# EAGLE design t10_adapter_isp (EAGLE 6.1)
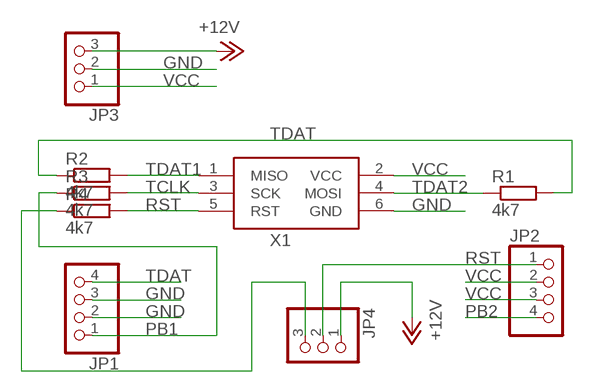
[diagram p0: schematic, sheet 1]

## Parts
JP1  PINHD-1X4  [1X04]
JP2  PINHD-1X4  [1X04]
JP3  PINHD-1X3  [1X03]
JP4  PINHD-1X3  [1X03]
R1  4k7  R-EU_M0805  [M0805]
R2  4k7  R-EU_M0805  [M0805]
R3  4k7  R-EU_M0805  [M0805]
R4  4k7  R-EU_M0805  [M0805]
X1  AVRISP-HEADER-6-SHROUDED  [CONN-HARTING-ML6]

## Nets
+12V: JP3.3 JP4.1
GND: JP1.2 JP1.3 JP3.2 X1.6(GND)
N$1: JP4.3 R4.1
PB1: JP1.1 R3.1
PB2: JP2.4
RST: JP2.1 JP4.2 R4.2 X1.5(RST)
TCLK: R3.2 X1.3(SCK)
TDAT: JP1.4 R1.2 R2.1
TDAT1: R2.2 X1.1(MISO)
TDAT2: R1.1 X1.4(MOSI)
VCC: JP2.2 JP2.3 JP3.1 X1.2(VCC)

## Library data of the parts
JP1 JP2 = pinhead:PINHD-1X4: PIN HEADER
JP3 JP4 = pinhead:PINHD-1X3: PIN HEADER
R1-R4 = rcl:R-EU_: RESISTOR, European symbol
X1 = SteveMarple:AVRISP: AVR ISP HEADER Standard 6 pin header for AVR programming

## Board
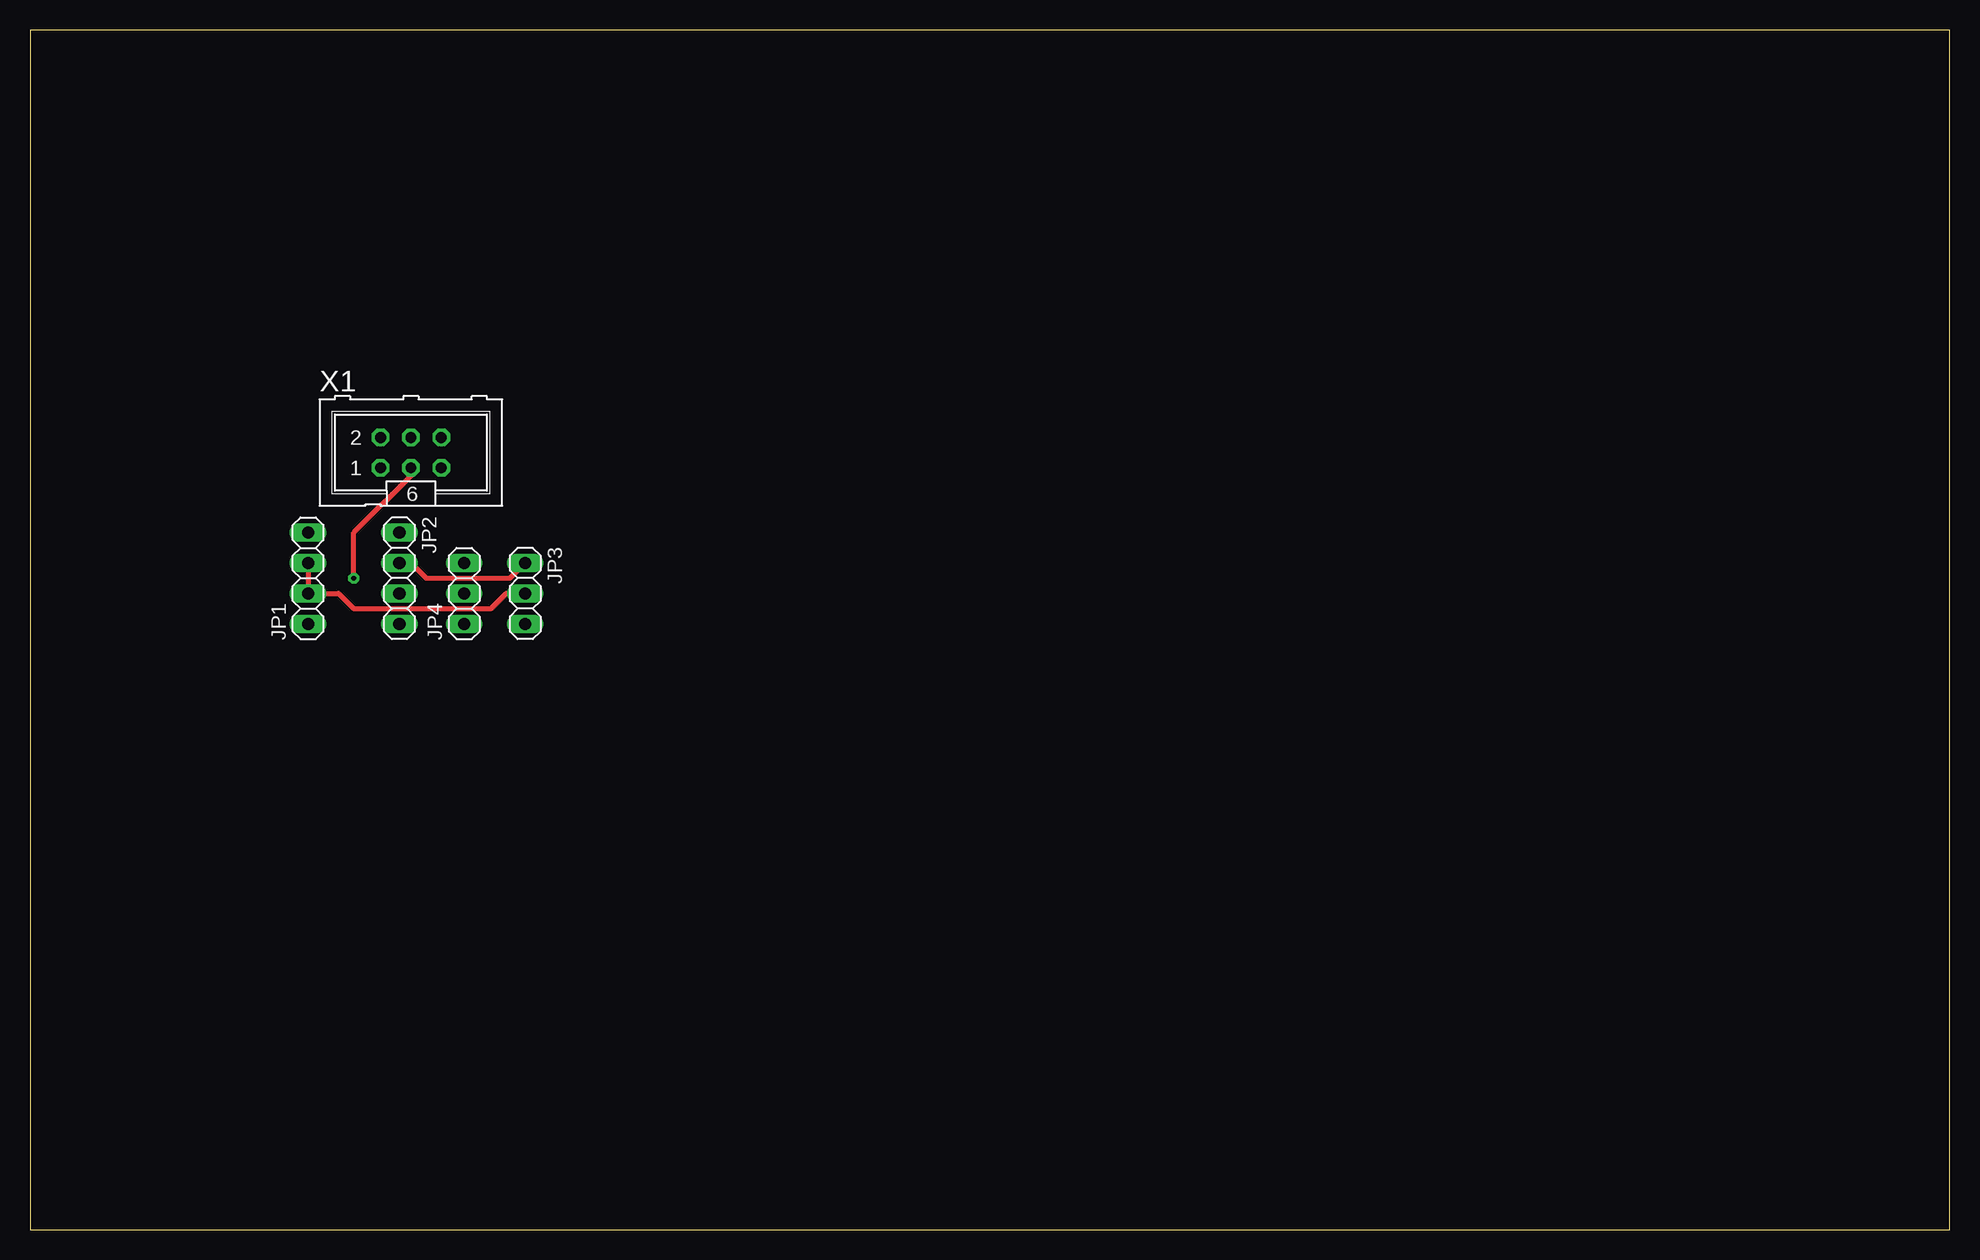
[diagram p1: board, top side]
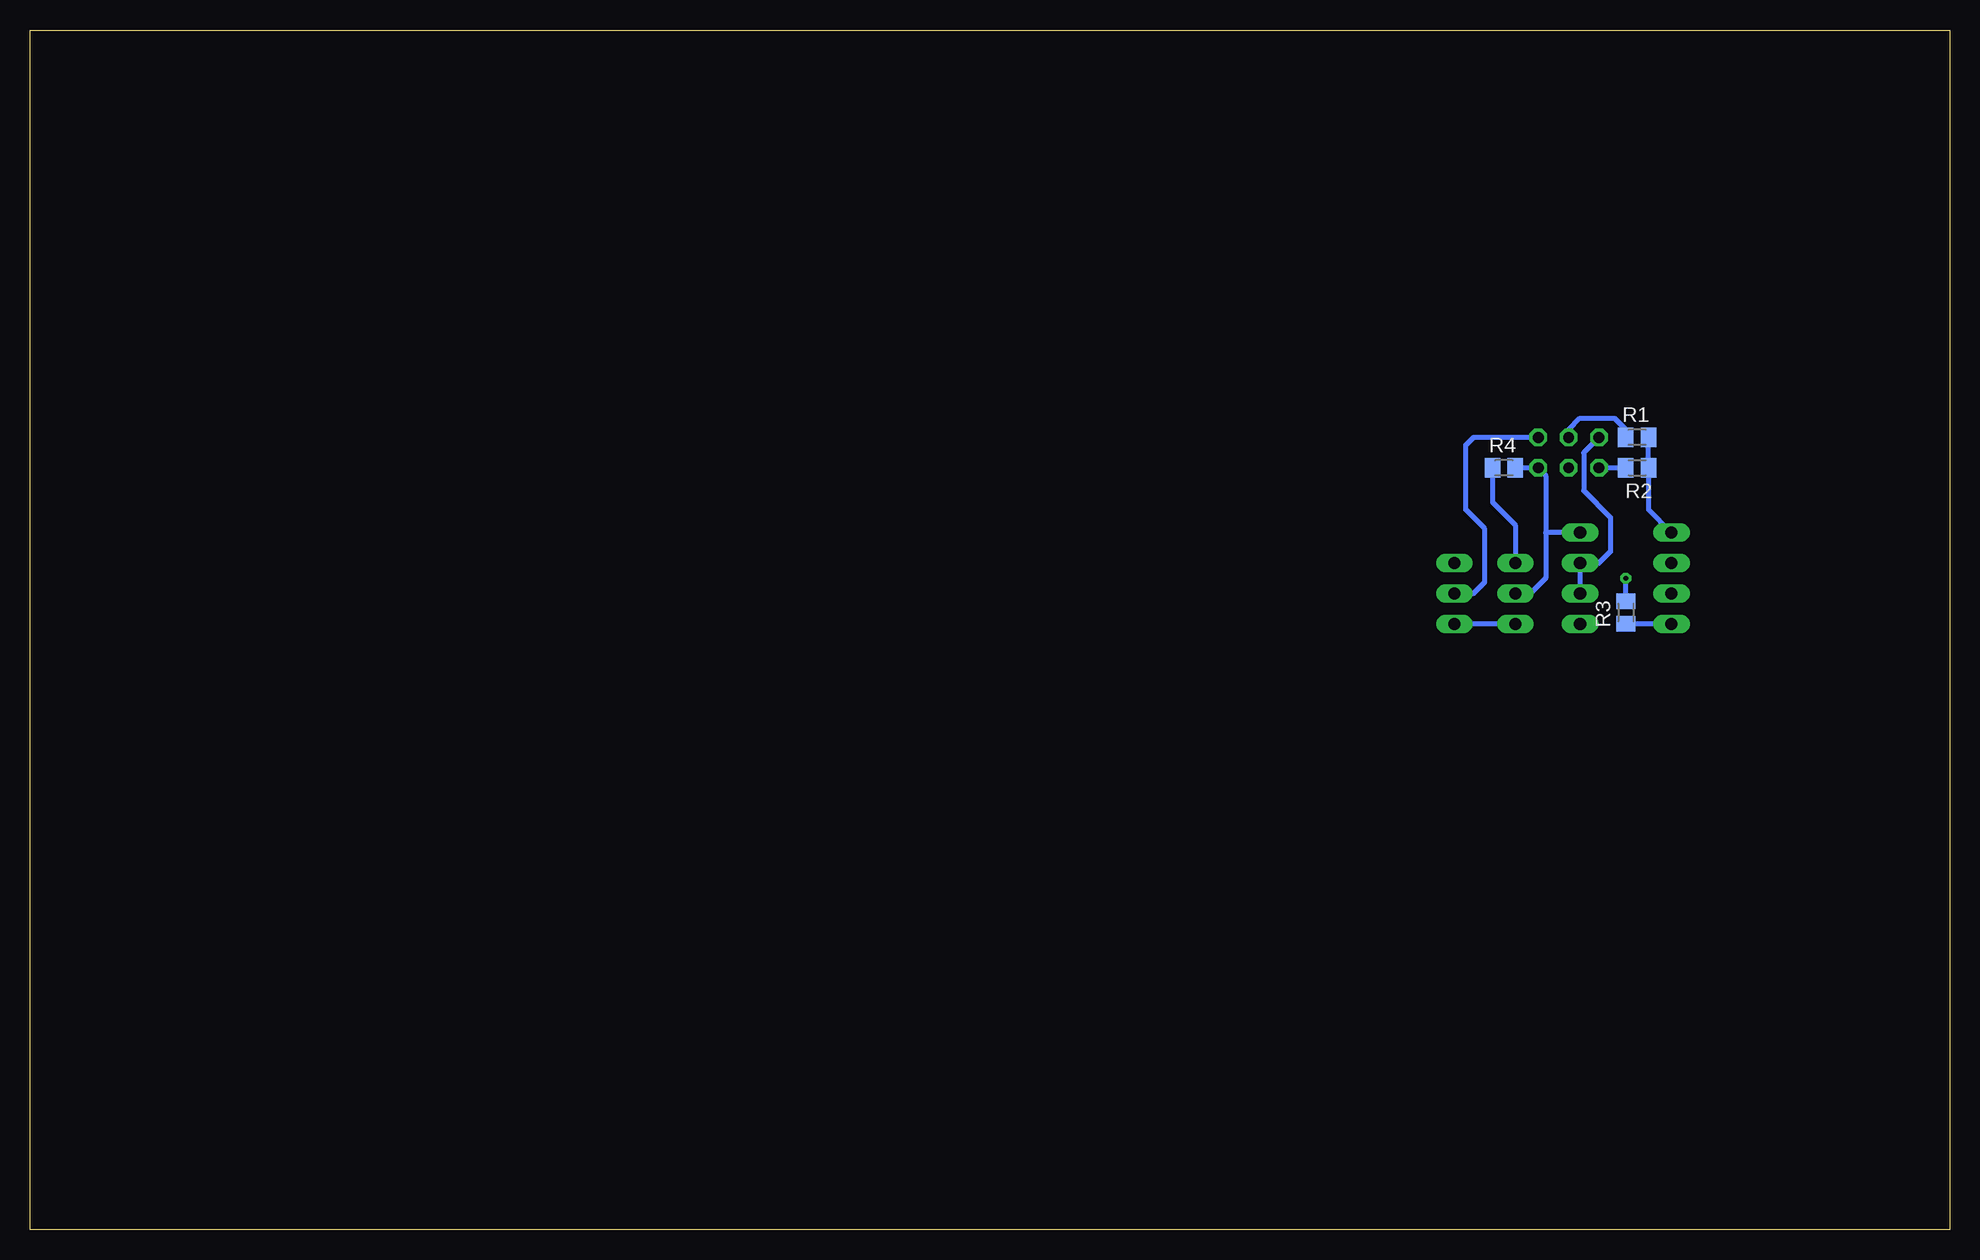
[diagram p2: board, bottom side, seen from below]

Size 160 x 100 mm. Coordinates in mm from the lower left corner, seen from the top.
Outline: 0,0 160,0 160,100 0,100 0,0
Copper layers (1*16): Top 0.035mm / dielectric 1.5mm / Bottom 0.035mm
Design rules: minimum track width 10mil, minimum drill 24mil, track to track 12mil, track to pad 12mil, pad to pad 12mil, via to via 12mil, smd to smd 10mil, copper to edge 12mil, drill to drill 12mil, minimum pad ring 10mil, minimum via ring 10mil, stop-mask expansion 4mil, vias tented up to drill 0mil, thermal gap 12mil

### Footprints (pad centres in the part's own frame; a part is rotated, then mirrored left to right if it is on the bottom)
1X04 = drill 1.016 long: 1 -3.81,0; 2 -1.27,0; 3 1.27,0; 4 3.81,0
1X03 = drill 1.016 long: 1 -2.54,0; 2 0,0; 3 2.54,0
M0805 = smd 1.3 x 1.6: 1 -0.95,0; 2 0.95,0
CONN-HARTING-ML6 = drill 0.914 octagon: 1 -2.54,-1.27; 2 -2.54,1.27; 3 0,-1.27; 4 0,1.27; 5 2.54,-1.27; 6 2.54,1.27

### Placement (x,y rotation side)
JP1  23.18,54.29 90 top
JP2  30.8,54.29 270 top
JP3  41.27,53.02 270 top
JP4  36.2,53.02 90 top
R1  26.04,66.04 0 bottom
R2  26.04,63.5 180 bottom
R3  26.99,51.44 90 bottom
R4  37.15,63.5 0 bottom
X1  31.75,64.77 0 top

### Tracks (layer width: path | path; a pad name or v marks a point on that pad's centre or on a via)
+12V
  Bottom 0.406: JP4.1 JP3.3
GND
  Top 0.406: JP3.2 39.69,53.02 38.42,51.75 26.99,51.75 25.72,53.02 JP1.2 JP1.3
  Bottom 0.406: X1.6 39.69,66.04 40.32,65.41 40.32,60.01 38.73,58.42 38.73,53.98 39.69,53.02 JP3.2
N$1
  Bottom 0.406: R4.1 38.1,60.64 36.2,58.74 JP4.3
PB1
  Bottom 0.406: JP1.1 R3.1
RST
  Bottom 0.406: R4.2 X1.5 33.66,62.87 33.66,58.1 | 33.66,58.1 33.66,54.29 34.92,53.02 JP4.2 | JP2.1 33.66,58.1
TCLK  (via drill 0.41)
  Top 0.406: v26.99,54.29 26.99,58.1 31.75,62.87 X1.3
  Bottom 0.406: R3.2 v26.99,54.29
TDAT
  Bottom 0.406: JP1.4 25.08,60.01 R2.1 R1.2
TDAT1
  Bottom 0.406: R2.2 X1.1
TDAT2
  Bottom 0.406: R1.1 26.98,66.67 27.94,67.63 30.8,67.63 31.75,66.67 X1.4
VCC
  Top 0.406: JP2.2 31.75,55.56 33.02,54.29 40.01,54.29 JP3.1
  Bottom 0.406: X1.2 30.48,64.77 30.48,61.59 28.26,59.37 28.26,56.52 29.21,55.56 JP2.2 JP2.3